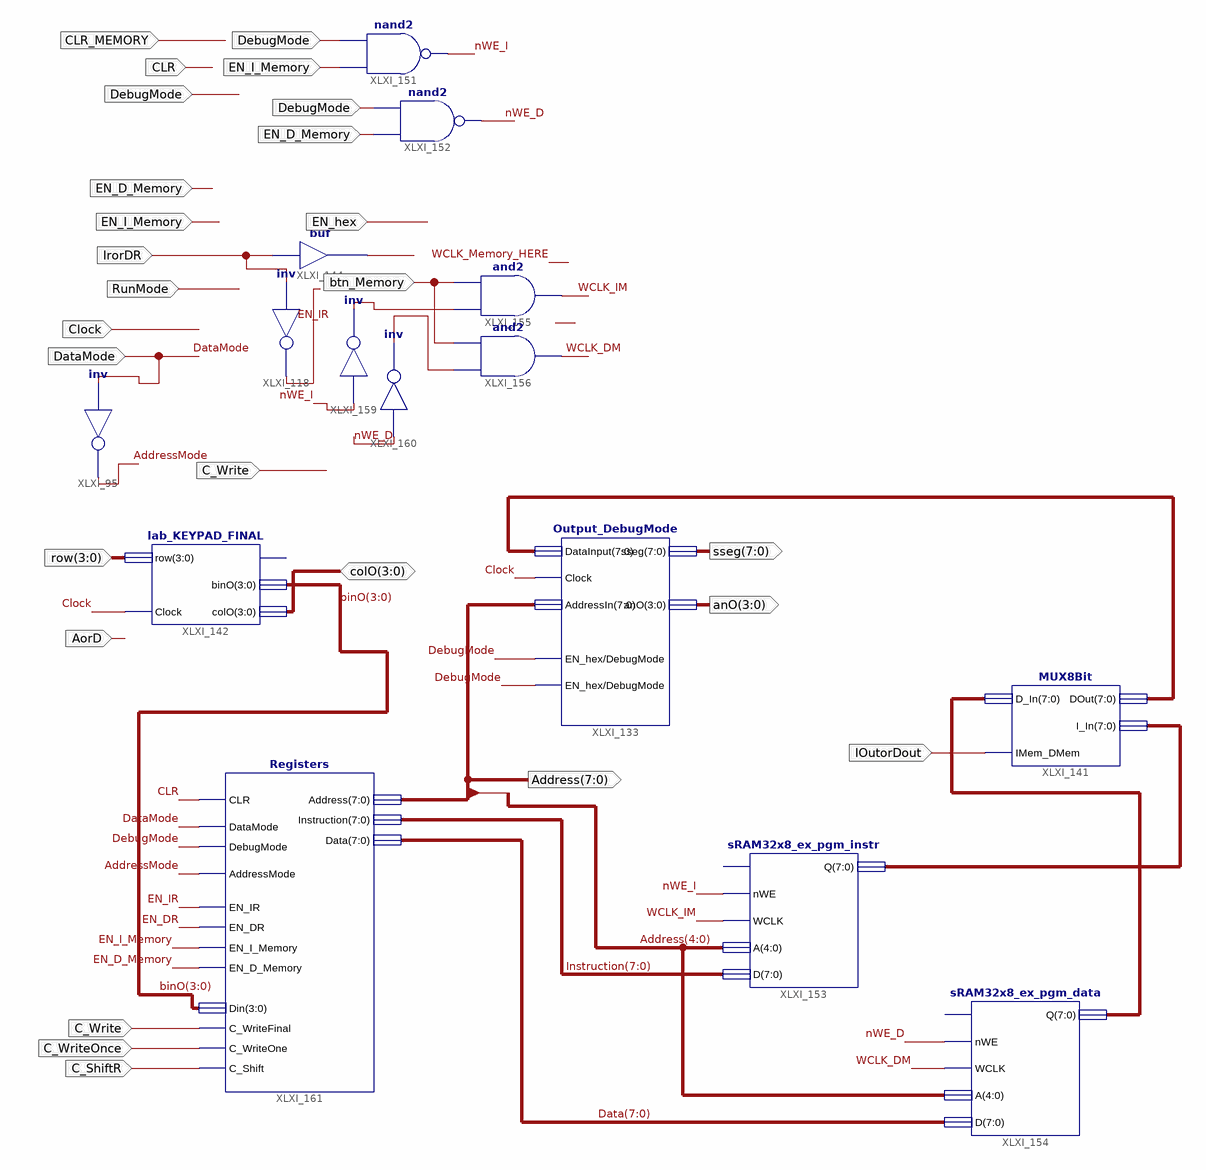
[diagram p0: schematic sheet 1]
// Xilinx ISE schematic Memory.sch (spartan3e) as structural Verilog: 15 symbols, 21 ports
module Memory (
  input  DebugMode,
  input  CLR,
  input  Clock,
  input  RunMode,
  input  CLR_MEMORY,
  input  EN_I_Memory,
  input  DataMode,
  input  EN_D_Memory,
  input  AorD,
  input  EN_hex,
  input  [3:0] row,
  input  IrorDR,
  input  btn_Memory,
  input  IOutorDout,
  input  C_Write,
  input  C_WriteOnce,
  input  C_ShiftR,
  inout  [3:0] colO,
  output [7:0] sseg,
  output [3:0] anO,
  output [7:0] Address
);

  wire AddressMode, EN_DR, EN_IR, nWE_D, nWE_I, WCLK_DM, WCLK_IM, XLXN_454, XLXN_456;
  wire [3:0] binO;
  wire [7:0] Data, Instruction, XLXN_463, XLXN_466, XLXN_468;

  not XLXI_95 (AddressMode, DataMode);
  not XLXI_118 (EN_IR, IrorDR);
  Output_DebugMode XLXI_133 (
    .DataInput(XLXN_468), .Clock(Clock), .EN_hex(DebugMode), .DebugMode(DebugMode), .AddressIn(Address),
    .sseg(sseg), .anO(anO));
  MUX8Bit XLXI_141 (.D_In(XLXN_463), .I_In(XLXN_466), .IMem_DMem(IOutorDout), .DOut(XLXN_468));
  lab_KEYPAD_FINAL XLXI_142 (.Clock(Clock), .row(row), .colO(colO), .binO(binO));  // open: keyO
  buf XLXI_144 (EN_DR, IrorDR);
  nand XLXI_151 (nWE_I, EN_I_Memory, DebugMode);
  nand XLXI_152 (nWE_D, EN_D_Memory, DebugMode);
  sRAM32x8_ex_pgm_instr XLXI_153 (
    .nWE(nWE_I), .WCLK(WCLK_IM), .A(Address[4:0]), .D(Instruction), .Q(XLXN_466));  // open: nCS
  sRAM32x8_ex_pgm_data XLXI_154 (.nWE(nWE_D), .WCLK(WCLK_DM), .A(Address[4:0]), .D(Data), .Q(XLXN_463));  // open: nCS
  and XLXI_155 (WCLK_IM, XLXN_454, btn_Memory);
  and XLXI_156 (WCLK_DM, XLXN_456, btn_Memory);
  not XLXI_159 (XLXN_454, nWE_I);
  not XLXI_160 (XLXN_456, nWE_D);
  Registers XLXI_161 (
    .CLR(CLR), .DebugMode(DebugMode), .AddressMode(AddressMode), .EN_IR(EN_IR), .EN_DR(EN_DR),
    .EN_D_Memory(EN_D_Memory), .DataMode(DataMode), .Din(binO), .C_WriteFinal(C_Write),
    .C_WriteOne(C_WriteOnce), .C_Shift(C_ShiftR), .EN_I_Memory(EN_I_Memory), .Address(Address),
    .Instruction(Instruction), .Data(Data));
endmodule
